# Altium project ROV_PCB_3.PrjPcb
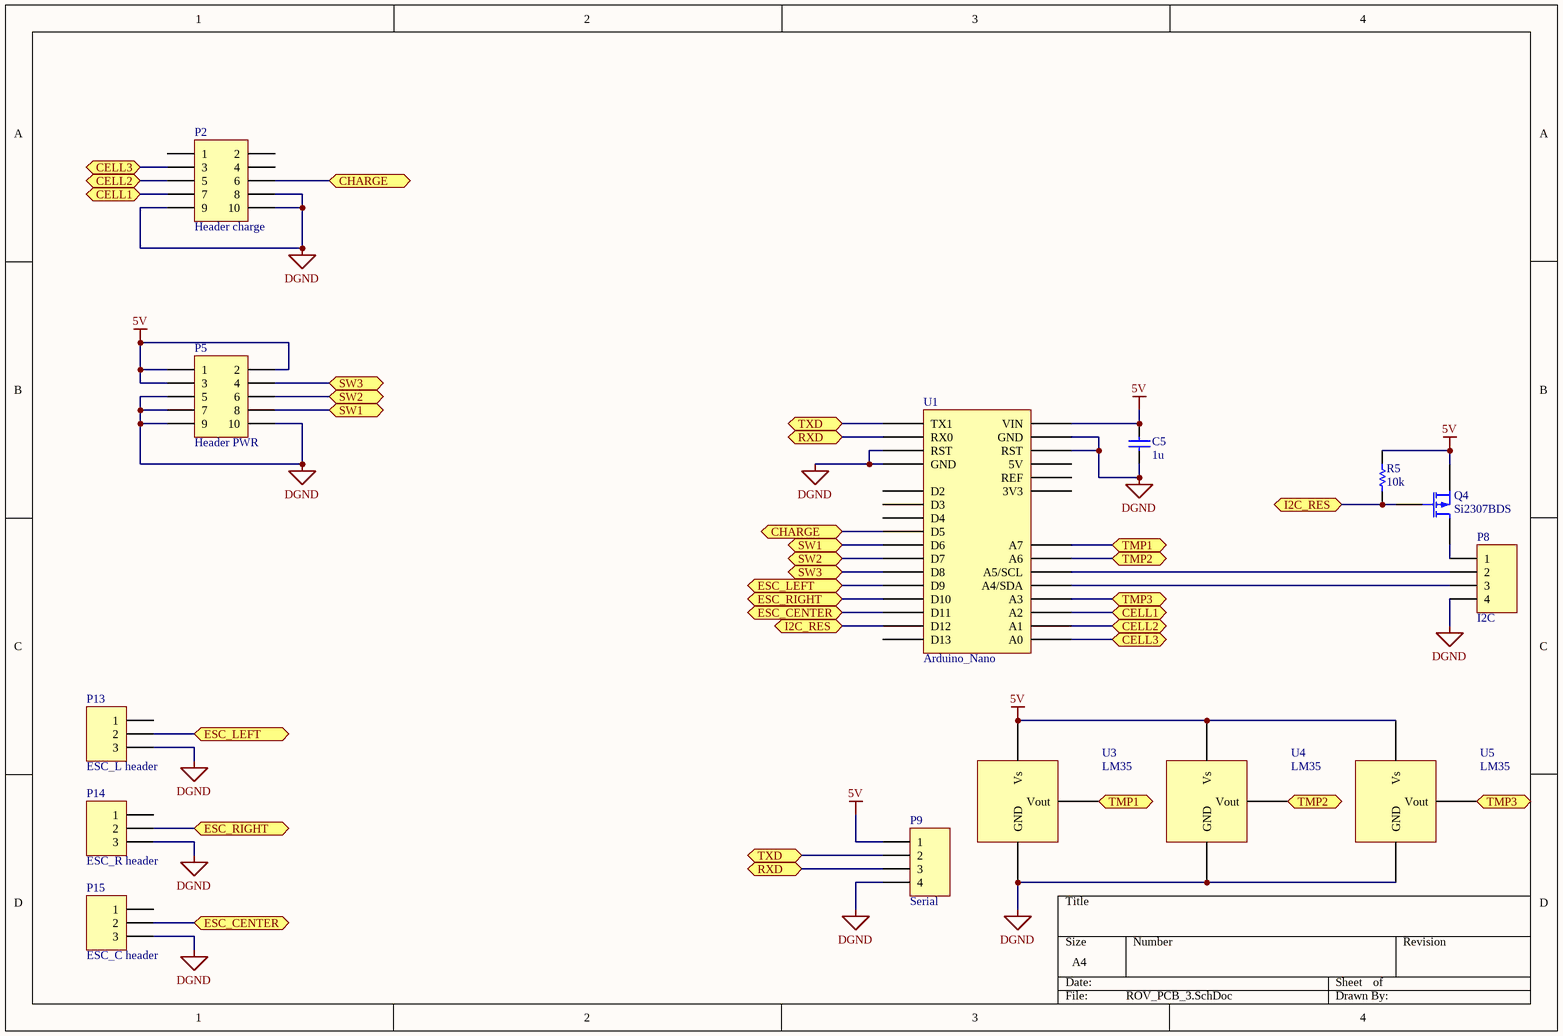
[diagram p0: ROV_PCB_3.SchDoc]
1 sheet, 14 parts. Net scope: flat (ports and power ports of the same name join across sheets).
Board file: ROV_PCB_3.PcbDoc

## Sheet ROV_PCB_3.SchDoc
size A4; PageSetup: Record=PageOptions|CenterHorizontal=True|CenterVertical=True|PrintScale=0.96|XCorrection=1.00|YCorrection=1.00|PrintKind=1|BorderSize=5000000|LeftOffset=0|BottomOffset=0|Orientation=2|PaperLength=1000|PaperWidth=1000|Scale=100|PaperSource=257|PrintQuality=600|MediaType=1|DitherType=10|PrintScaleMode=1|PaperKind=A4|PaperIndex=9

### Parts
C5  1u  [RAD-0.1]
P2  Header charge  [HDR2X5]
P5  Header PWR  [HDR2X5]
P8  I2C  [HDR1X4]
P9  Serial  [HDR1X4]
P13  ESC_L header  [HDR1X3]
P14  ESC_R header  [HDR1X3]
P15  ESC_C header  [HDR1X3]
Q4  Si2307BDS  [SOT23_M]
R5  10k  [AXIAL-0.3]
U1  Arduino_Nano  [DIP30]
U3  LM35  [HDR1X3]
U4  LM35  [HDR1X3]
U5  LM35  [HDR1X3]

### Ports
CELL1, CELL2, CELL3, CHARGE, ESC_CENTER, ESC_LEFT, ESC_RIGHT, I2C_RES, RXD, SW1, SW2, SW3, TMP1, TMP2, TMP3, TXD

### Nets
5V: C5.2 P5.1 P5.2 P5.3 P9.1 Q4.2(S) R5.2 U1.30(VIN) U3.1(Vs) U4.1(Vs) U5.1(Vs)
DGND: C5.1 P2.8 P2.9 P2.10 P5.5 P5.7 P5.9 P5.10 P8.4 P9.4 P13.3 P14.3 P15.3 U1.3(RST) U1.4(GND) U1.28(RST) U1.29(GND) U3.3(GND) U4.3(GND) U5.3(GND)
NetP2_3: P2.3 U1.19(A0) ; port CELL3
NetP2_5: P2.5 U1.20(A1) ; port CELL2
NetP2_6: P2.6 U1.8(D5) ; port CHARGE
NetP2_7: P2.7 U1.21(A2) ; port CELL1
NetP5_4: P5.4 U1.11(D8) ; port SW3
NetP5_6: P5.6 U1.10(D7) ; port SW2
NetP5_8: P5.8 U1.9(D6) ; port SW1
NetP8_1: P8.1 Q4.1(D)
NetP8_2: P8.2 U1.24(A5/SCL)
NetP8_3: P8.3 U1.23(A4/SDA)
NetP9_2: P9.2 U1.1(TX1) ; port TXD
NetP9_3: P9.3 U1.2(RX0) ; port RXD
NetP13_2: P13.2 U1.12(D9) ; port ESC_LEFT
NetP14_2: P14.2 U1.13(D10) ; port ESC_RIGHT
NetP15_2: P15.2 U1.14(D11) ; port ESC_CENTER
NetQ4_3: Q4.3(G) R5.1 U1.15(D12) ; port I2C_RES
NetU1_22: U1.22(A3) U5.2(Vout) ; port TMP3
NetU1_25: U1.25(A6) U4.2(Vout) ; port TMP2
NetU1_26: U1.26(A7) U3.2(Vout) ; port TMP1

Not connected (* = marked no-connect by the designer): P2 1 2 4; P13 1; P14 1; P15 1; U1 5(D2) 6(D3) 7(D4) 16(D13) 17(3V3) 18(REF) 27(5V)

### Library data of the parts
C5 = Cap: Capacitor; Part number: C2190; Value: 100n; Published: 8-Jun-2000; LatestRevisionDate: 17-Jul-2002; LatestRevisionNote: Re-released for DXP Platform.; PackageReference: RAD-0.3; Publisher: Altium Limited; PackageDescription: Radial Cap, Thru-Hole; 2 Leads; 0.3 in Pin Spacing; Supplier: Kronos; Unit price: 0.74 kn
P2 P5 = Header 5X2: Header, 5-Pin, Dual row; LatestRevisionDate: 17-Jul-2002; LatestRevisionNote: Re-released for DXP Platform.; Publisher: Altium Limited
P8 P9 = Header 4: Header, 4-Pin; LatestRevisionDate: 17-Jul-2002; LatestRevisionNote: Re-released for DXP Platform.; Publisher: Altium Limited
P13-P15 = Header 3: Header, 3-Pin; LatestRevisionDate: 17-Jul-2002; LatestRevisionNote: Re-released for DXP Platform.; Publisher: Altium Limited
Q4 = MOSFET-P: P-Channel MOSFET; Published: 8-Jun-2000; LatestRevisionDate: 17-Jul-2002; LatestRevisionNote: Re-released for DXP Platform.; PackageVersion: 1995/1996; PackageReference: E3; Publisher: Altium Limited; PackageDescription: TO, Flat Index; 3 In-Line, Axial Leads; Body Dia. 4.6mm; Lead Dia. 0.5 mm (max); Supplier: Elmatis; Unit price: 4.00 kn
R5 = Res1: Resistor; Value: 1K; Published: 8-Jun-2000; LatestRevisionDate: 17-Jul-2002; LatestRevisionNote: Re-released for DXP Platform.; PackageReference: AXIAL-0.3; Publisher: Altium Limited; PackageDescription: Axial Device, Thru-Hole; 2 Leads; 0.3 in Pin Spacing
U3-U5 = LM35: pin to pad: 2>3 3>2